# Altium project Enigma Rev A.PrjPCB (part 6 of 10)

## Sheet USB Hub.SchDoc: USB HUB
size Tabloid; ApprovedBy: NA; CompanyName: Cospan Design LLC; DrawnBy: Dave McCoy; Engineer: Dave McCoy; DocumentNumber: 9; Revision: A; SheetNumber: 9; SheetTotal: 20; Client: Public; Project: Enigma; ProjectPrettyName: Enigma
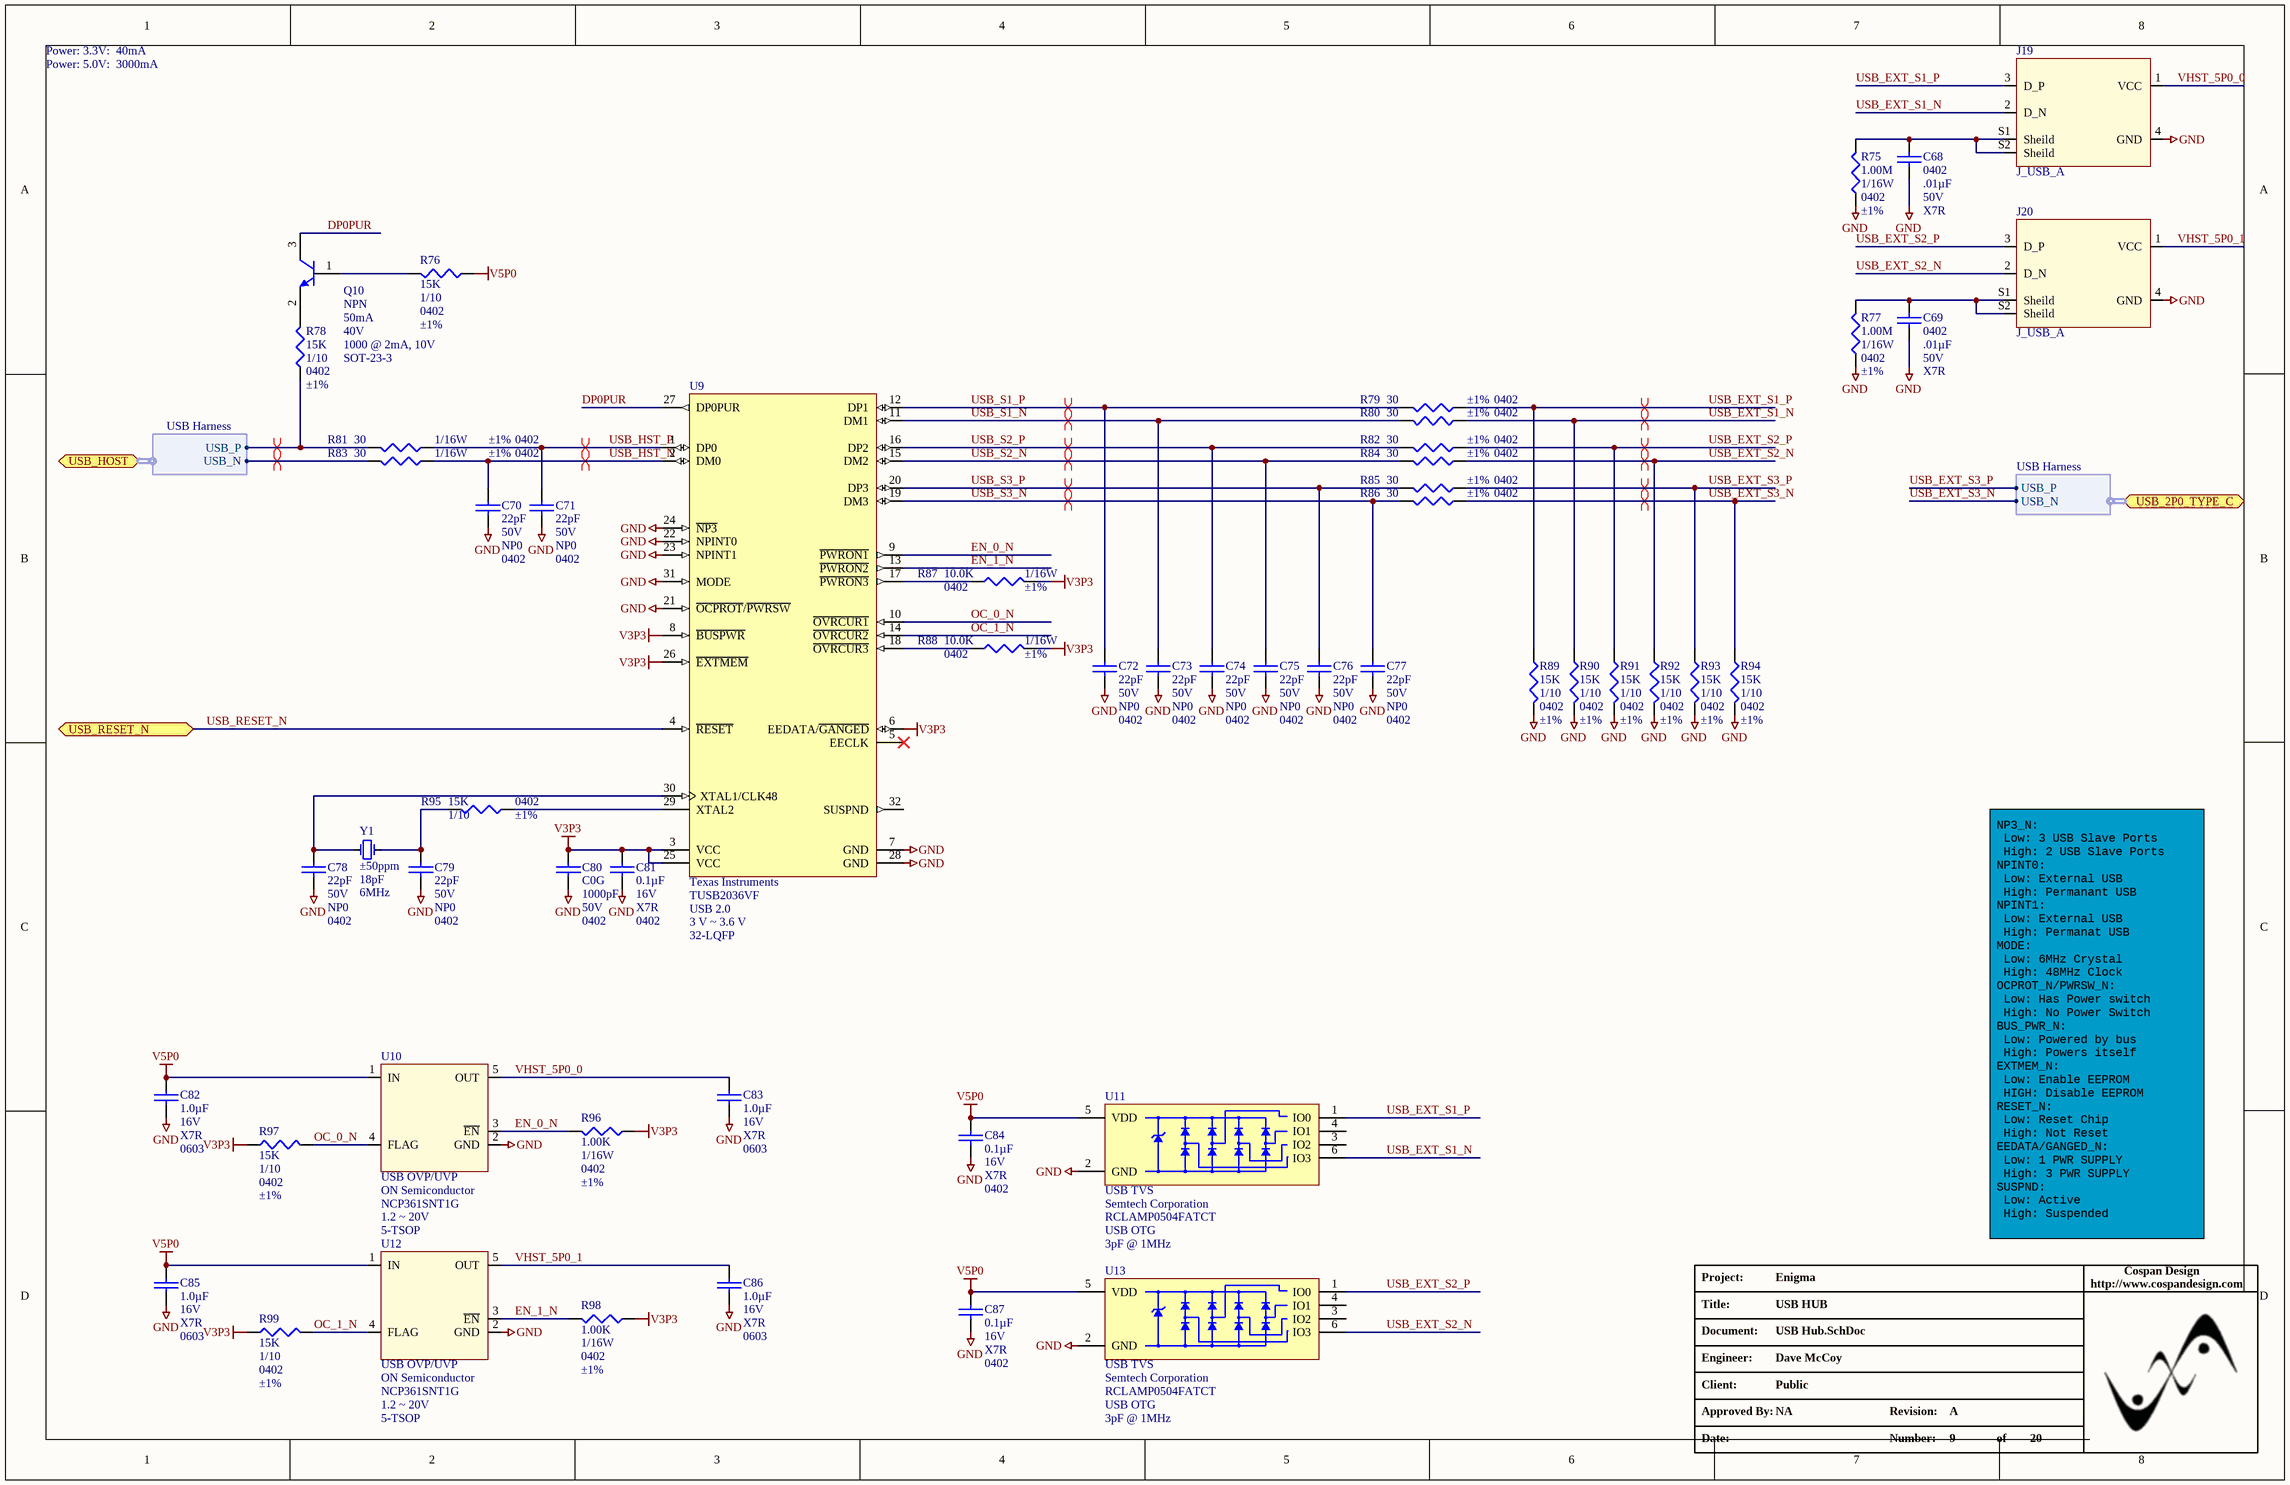
[diagram p11: USB Hub.SchDoc]

### Parts
C68  Package / Case: 0402  Capacitance: .01µF  Voltage - Rated: 50V  Temperature Coefficient: X7R  [C_0402]  (hidden comment: 10000pF)
C69  Package / Case: 0402  Capacitance: .01µF  Voltage - Rated: 50V  Temperature Coefficient: X7R  [C_0402]  (hidden comment: 10000pF)
C70  Voltage - Rated: 50V  Temperature Coefficient: NP0  Package / Case: 0402  [C_ERA-0402]  (hidden comment: 22pF)
C71  Voltage - Rated: 50V  Temperature Coefficient: NP0  Package / Case: 0402  [C_ERA-0402]  (hidden comment: 22pF)
C72  Voltage - Rated: 50V  Temperature Coefficient: NP0  Package / Case: 0402  [C_ERA-0402]  (hidden comment: 22pF)
C73  Voltage - Rated: 50V  Temperature Coefficient: NP0  Package / Case: 0402  [C_ERA-0402]  (hidden comment: 22pF)
C74  Voltage - Rated: 50V  Temperature Coefficient: NP0  Package / Case: 0402  [C_ERA-0402]  (hidden comment: 22pF)
C75  Voltage - Rated: 50V  Temperature Coefficient: NP0  Package / Case: 0402  [C_ERA-0402]  (hidden comment: 22pF)
C76  Voltage - Rated: 50V  Temperature Coefficient: NP0  Package / Case: 0402  [C_ERA-0402]  (hidden comment: 22pF)
C77  Voltage - Rated: 50V  Temperature Coefficient: NP0  Package / Case: 0402  [C_ERA-0402]  (hidden comment: 22pF)
C78  Voltage - Rated: 50V  Temperature Coefficient: NP0  Package / Case: 0402  [C_ERA-0402]  (hidden comment: 22pF)
C79  Voltage - Rated: 50V  Temperature Coefficient: NP0  Package / Case: 0402  [C_ERA-0402]  (hidden comment: 22pF)
C80  Temperature Coefficient: C0G  Voltage - Rated: 50V  Package / Case: 0402  [C_0402]  (hidden comment: 1000pF)
C81  Capacitance: 0.1µF  Voltage - Rated: 16V  Temperature Coefficient: X7R  Package / Case: 0402  [C_0402]  (hidden comment: 0.1uF)
C82  Capacitance: 1.0µF  Voltage - Rated: 16V  Temperature Coefficient: X7R  Package / Case: 0603  [C_ERA-0603]  (hidden comment: 1.0uF)
C83  Capacitance: 1.0µF  Voltage - Rated: 16V  Temperature Coefficient: X7R  Package / Case: 0603  [C_ERA-0603]  (hidden comment: 1.0uF)
C84  Capacitance: 0.1µF  Voltage - Rated: 16V  Temperature Coefficient: X7R  Package / Case: 0402  [C_0402]  (hidden comment: 0.1uF)
C85  Capacitance: 1.0µF  Voltage - Rated: 16V  Temperature Coefficient: X7R  Package / Case: 0603  [C_ERA-0603]  (hidden comment: 1.0uF)
C86  Capacitance: 1.0µF  Voltage - Rated: 16V  Temperature Coefficient: X7R  Package / Case: 0603  [C_ERA-0603]  (hidden comment: 1.0uF)
C87  Capacitance: 0.1µF  Voltage - Rated: 16V  Temperature Coefficient: X7R  Package / Case: 0402  [C_0402]  (hidden comment: 0.1uF)
J19  J_USB_A  [USB_A]
J20  J_USB_A  [USB_A]
Q10  Current - Collector (Ic) (Max): 50mA  Voltage - Collector Emitter Breakdown (Max): 40V  DC Current Gain (hFE) (Min) @ Ic, Vce: 1000 @ 2mA, 10V  Package / Case: SOT-23-3  [SOT-23A]  (hidden comment: NPN)
R75  Resistance In Ohms: 1.00M  Power (Watts): 1/16W  Case: 0402  Tolerance: ±1%  [R_0402]  (hidden comment: 1.0M Ohms)
R76  Resistance In Ohms: 15K  Power (Watts): 1/10  Case: 0402  Tolerance: ±1%  [R_0402]  (hidden comment: R_0402_15.0K)
R77  Resistance In Ohms: 1.00M  Power (Watts): 1/16W  Case: 0402  Tolerance: ±1%  [R_0402]  (hidden comment: 1.0M Ohms)
R78  Resistance In Ohms: 15K  Power (Watts): 1/10  Case: 0402  Tolerance: ±1%  [R_0402]  (hidden comment: R_0402_15.0K)
R79  Resistance In Ohms: 30  Case: 0402  Tolerance: ±1%  [R_0402]  (hidden comment: R_0402_30)
R80  Resistance In Ohms: 30  Case: 0402  Tolerance: ±1%  [R_0402]  (hidden comment: R_0402_30)
R81  Resistance In Ohms: 30  Power (Watts): 1/16W  Case: 0402  Tolerance: ±1%  [R_0402]  (hidden comment: R_0402_30)
R82  Resistance In Ohms: 30  Case: 0402  Tolerance: ±1%  [R_0402]  (hidden comment: R_0402_30)
R83  Resistance In Ohms: 30  Power (Watts): 1/16W  Case: 0402  Tolerance: ±1%  [R_0402]  (hidden comment: R_0402_30)
R84  Resistance In Ohms: 30  Case: 0402  Tolerance: ±1%  [R_0402]  (hidden comment: R_0402_30)
R85  Resistance In Ohms: 30  Case: 0402  Tolerance: ±1%  [R_0402]  (hidden comment: R_0402_30)
R86  Resistance In Ohms: 30  Case: 0402  Tolerance: ±1%  [R_0402]  (hidden comment: R_0402_30)
R87  Resistance In Ohms: 10.0K  Power (Watts): 1/16W  Case: 0402  Tolerance: ±1%  [R_0402]  (hidden comment: R_0402_10.0K)
R88  Resistance In Ohms: 10.0K  Power (Watts): 1/16W  Case: 0402  Tolerance: ±1%  [R_0402]  (hidden comment: R_0402_10.0K)
R89  Resistance In Ohms: 15K  Power (Watts): 1/10  Case: 0402  Tolerance: ±1%  [R_0402]  (hidden comment: R_0402_15.0K)
R90  Resistance In Ohms: 15K  Power (Watts): 1/10  Case: 0402  Tolerance: ±1%  [R_0402]  (hidden comment: R_0402_15.0K)
R91  Resistance In Ohms: 15K  Power (Watts): 1/10  Case: 0402  Tolerance: ±1%  [R_0402]  (hidden comment: R_0402_15.0K)
R92  Resistance In Ohms: 15K  Power (Watts): 1/10  Case: 0402  Tolerance: ±1%  [R_0402]  (hidden comment: R_0402_15.0K)
R93  Resistance In Ohms: 15K  Power (Watts): 1/10  Case: 0402  Tolerance: ±1%  [R_0402]  (hidden comment: R_0402_15.0K)
R94  Resistance In Ohms: 15K  Power (Watts): 1/10  Case: 0402  Tolerance: ±1%  [R_0402]  (hidden comment: R_0402_15.0K)
R95  Resistance In Ohms: 15K  Power (Watts): 1/10  Case: 0402  Tolerance: ±1%  [R_0402]  (hidden comment: R_0402_15.0K)
R96  Resistance In Ohms: 1.00K  Power (Watts): 1/16W  Case: 0402  Tolerance: ±1%  [R_0402]  (hidden comment: 1.0k Ohms)
R97  Resistance In Ohms: 15K  Power (Watts): 1/10  Case: 0402  Tolerance: ±1%  [R_0402]  (hidden comment: R_0402_15.0K)
R98  Resistance In Ohms: 1.00K  Power (Watts): 1/16W  Case: 0402  Tolerance: ±1%  [R_0402]  (hidden comment: 1.0k Ohms)
R99  Resistance In Ohms: 15K  Power (Watts): 1/10  Case: 0402  Tolerance: ±1%  [R_0402]  (hidden comment: R_0402_15.0K)
U9  Manufacturer: Texas Instruments  Manufacturer Part Number: TUSB2036VF  Standards: USB 2.0  Voltage - Supply: 3 V ~ 3.6 V  Package / Case: 32-LQFP  [VF32_L]  (hidden comment: U_TI-TUSB2036-LQFP_VF-32)
U10  USB OVP/UVP  Manufacturer: ON Semiconductor  Manufacturer Part Number: NCP361SNT1G  Voltage - Working: 1.2 ~ 20V  Supplier Device Package: 5-TSOP  [SOT95P280X90-5N]
U11  USB TVS  Manufacturer: Semtech Corporation  Manufacturer Part Number: RCLAMP0504FATCT  Applications: USB OTG  Capacitance @ Frequency: 3pF @ 1MHz  [SC70-LT6_N]
U12  USB OVP/UVP  Manufacturer: ON Semiconductor  Manufacturer Part Number: NCP361SNT1G  Voltage - Working: 1.2 ~ 20V  Supplier Device Package: 5-TSOP  [SOT95P280X90-5N]
U13  USB TVS  Manufacturer: Semtech Corporation  Manufacturer Part Number: RCLAMP0504FATCT  Applications: USB OTG  Capacitance @ Frequency: 3pF @ 1MHz  [SC70-LT6_N]
Y1  Frequency Stability: ±50ppm  Load Capacitance: 18pF  Frequency: 6MHz  [HC49]  (hidden comment: 6.00MHz Crystal)

### Ports
USB_2P0_TYPE_C (harness USB Harness), USB_HOST (harness USB Harness), USB_RESET_N

### Harnesses
USB Harness: USB_P, USB_N

### Nets
GND: C68.1 C69.1 C70.1 C71.1 C72.1 C73.1 C74.1 C75.1 C76.1 C77.1 C78.1 C79.1 C80.1 C81.1 C82.1 C83.1 C84.1 C85.1 C86.1 C87.1 J19.4(GND) J20.4(GND) R75.2 R77.2 R89.1 R90.1 R91.1 R92.1 R93.1 R94.1 U9.7(GND) U9.21(~{OCPROT}/~{PWRSW}) U9.22(NPINT0) U9.23(NPINT1) U9.24(~{NP3}) U9.28(GND) U9.31(MODE) U10.2(GND) U11.2(GND) U12.2(GND) U13.2(GND)
V3P3: C80.2 C81.2 R87.1 R88.1 R96.2 R97.2 R98.2 R99.2 U9.3(VCC) U9.6(EEDATA/~{GANGED}) U9.8(~{BUSPWR}) U9.25(VCC) U9.26(~{EXTMEM})
V5P0: C82.2 C84.2 C85.2 C87.2 R76.2 U10.1(IN) U11.5(VDD) U12.1(IN) U13.5(VDD)
DP0PUR: Q10.3(C) U9.27(DP0PUR)
EN_0_N: R96.1 U9.9(~{PWRON1}) U10.3(~{EN})
EN_1_N: R98.1 U9.13(~{PWRON2}) U12.3(~{EN})
OC_0_N: R97.1 U9.10(~{OVRCUR1}) U10.4(FLAG)
OC_1_N: R99.1 U9.14(~{OVRCUR2}) U12.4(FLAG)
USB_EXT_S1_N: J19.2(D_N) R80.2 R90.2 U11.6(IO3)
USB_EXT_S1_P: J19.3(D_P) R79.2 R89.2 U11.1(IO0)
USB_EXT_S2_N: J20.2(D_N) R84.2 R92.2 U13.6(IO3)
USB_EXT_S2_P: J20.3(D_P) R82.2 R91.2 U13.1(IO0)
USB_EXT_S3_N: R86.2 R94.2 ; port USB_2P0_TYPE_C.USB_N  [project net USB_2P0_N]
USB_EXT_S3_P: R85.2 R93.2 ; port USB_2P0_TYPE_C.USB_P  [project net USB_2P0_P]
USB_HOST_N: R83.1 ; port USB_HOST.USB_N
USB_HOST_P: R78.2 R81.1 ; port USB_HOST.USB_P
USB_HST_N: C70.2 R83.2 U9.2(DM0)
USB_HST_P: C71.2 R81.2 U9.1(DP0)
USB_RESET_N: U9.4(~{RESET}) ; port USB_RESET_N  [project net ULPI_RST_N]
USB_S1_N: C73.2 R80.1 U9.11(DM1)
USB_S1_P: C72.2 R79.1 U9.12(DP1)
USB_S2_N: C75.2 R84.1 U9.15(DM2)
USB_S2_P: C74.2 R82.1 U9.16(DP2)
USB_S3_N: C77.2 R86.1 U9.19(DM3)
USB_S3_P: C76.2 R85.1 U9.20(DP3)
VHST_5P0_0: C83.2 J19.1(VCC) U10.5(OUT)
VHST_5P0_1: C86.2 J20.1(VCC) U12.5(OUT)
NetC68_2: C68.2 J19.S1(Sheild) J19.S2(Sheild) R75.1
NetC69_2: C69.2 J20.S1(Sheild) J20.S2(Sheild) R77.1
NetC78_2: C78.2 U9.30(XTAL1/CLK48) Y1.2
NetC79_2: C79.2 R95.1 Y1.1
NetQ10_1: Q10.1(B) R76.1
NetQ10_2: Q10.2(E) R78.1
NetR87_2: R87.2 U9.17(~{PWRON3})
NetR88_2: R88.2 U9.18(~{OVRCUR3})
NetR95_2: R95.2 U9.29(XTAL2)

Not connected (* = marked no-connect by the designer): U9 5(EECLK)* 32(SUSPND); U11 3(IO2) 4(IO1); U13 3(IO2) 4(IO1)

### Layout directives
differential pair: USB_2P0_N, USB_2P0_P, USB_EXT_S1_N, USB_EXT_S1_P, USB_EXT_S2_N, USB_EXT_S2_P, USB_HOST_N, USB_HOST_P, USB_HST_N, USB_HST_P, USB_S1_N, USB_S1_P, USB_S2_N, USB_S2_P, USB_S3_N, USB_S3_P

### Notes on the sheet
- Power: 3.3V:  40mA
- Power: 5.0V:  3000mA
- NP3_N:
  Low: 3 USB Slave Ports
  High: 2 USB Slave Ports
  NPINT0:
  Low: External USB
  High: Permanant USB
  NPINT1:
  Low: External USB
  High: Permanat USB
  MODE:
  Low: 6MHz Crystal
  High: 48MHz Clock
  OCPROT_N/PWRSW_N:
  Low: Has Power switch
  High: No Power Switch
  BUS_PWR_N:
  Low: Powered by bus
  High: Powers itself
  EXTMEM_N:
  Low: Enable EEPROM
  HIGH: Disable EEPROM
  RESET_N:
  Low: Reset Chip
  High: Not Reset
  EEDATA/GANGED_N:
  Low: 1 PWR SUPPLY
  High: 3 PWR SUPPLY
  SUSPND:
  Low: Active
  High: Suspended
- Project:
- http://www.cospandesign.com
- Cospan Design
- Document:
- Engineer:
- Title:
- Client:
- Approved By:
- Revision:
- Date:
- Number:
- of

### Library data of the parts
C68 C69 = C_0402_10000PF_50V: CAP CERAMIC .01UF 50V X7R 0402; Manufacturer: Murata Electronics North America; Manufacturer Part Number: GRM155R71H103KA88D; Tolerance: ±10%; Supplier 1: Digi-Key; RoHS: RoHS Compliant; Category: Capacitors; Stock 1: 7255009; Pricing 1: 1=0.1, 50=0.0052, 100=0.0044, 250=0.00364, 500=0.00312, 1000=0.00242, 5000=0.00202 (USD); Packaging: Cut Tape (CT); Part Status: Active; Operating Temperature: -55°C ~ 125°C; Features: -; Ratings: -; Applications: General Purpose; Mounting Type: Surface Mount, MLCC; Size / Dimension: 0.039" L x 0.020" W (1.00mm x 0.50mm); Height - Seated (Max): -; Thickness (Max): 0.022" (0.55mm); Lead Spacing: -; Lead Style: -; ComponentLink1URL: http://www.murata.com/~/media/webrenewal/support/library/catalog/products/capacitor/mlcc/c02e.ashx; ComponentLink1Description: http://www.murata.com/~/media/webrenewal/support/library/catalog/products/capacitor/mlcc/c02e.ashx; Supplier Part Number 1: 490-4516-1-ND
C70-C79 = C_0402_22PF_50V: CAP CER 22PF 50V NP0 0402; Manufacturer: Murata Electronics North America; Manufacturer Part Number: GRM1555C1H220FA01D; Tolerance: ±1%; Description: CAP CER 22PF 50V C0G/NP0 0402; Supplier 1: Digi-Key; RoHS: RoHS Compliant; Category: Capacitors; Stock 1: 606100; Pricing 1: 1=0.1, 10=0.05, 100=0.0223, 500=0.01594, 1000=0.01252, 2500=0.01138, 5000=0.01047 (USD); Packaging: Cut Tape (CT); Part Status: Active; Operating Temperature: -55°C ~ 125°C; Features: -; Ratings: -; Applications: General Purpose; Mounting Type: Surface Mount, MLCC; Size / Dimension: 0.039" L x 0.020" W (1.00mm x 0.50mm); Height - Seated (Max): -; Thickness (Max): 0.022" (0.55mm); Lead Spacing: -; Lead Style: -; ComponentLink1URL: http://search.murata.co.jp/Ceramy/image/img/A01X/G101/ENG/GRM1555C1H220FA01-01.pdf; ComponentLink1Description: http://search.murata.co.jp/Ceramy/image/img/A01X/G101/ENG/GRM1555C1H220FA01-01.pdf; Supplier Part Number 1: 490-8589-1-ND; Capacitance: 22pF
C80 = C_0402_1000PF_50V: CAP CER 1000PF 50V C0G 0402; Manufacturer: Murata Electronics North America; Manufacturer Part Number: GRM1555C1H102JA01D; Tolerance: ±5%; Supplier 1: Digi-Key; RoHS: RoHS Compliant; Category: Capacitors; Stock 1: 1327660; Pricing 1: 10=0.073, 100=0.0429, 500=0.02476, 1000=0.01716 (USD); Mounting Type: Surface Mount, MLCC; Operating Temperature: -55°C ~ 125°C; Features: -; Applications: General Purpose; Ratings: -; Size / Dimension: 0.040" L x 0.020" W (1.00mm x 0.50mm); Lead Spacing: -; Thickness: 0.50mm; Packaging: Cut Tape (CT); Lead Style: -; ComponentLink1URL: http://search.murata.co.jp/Ceramy/image/img/PDF/ENG/GRM1555C1H102JA01.pdf; ComponentLink1Description: http://search.murata.co.jp/Ceramy/image/img/PDF/ENG/GRM1555C1H102JA01.pdf; Supplier Part Number 1: 490-3244-1-ND; Capacitance: 1000pF
C81 C84 C87 = C_0402_0.1UF_16V: CAP CER .10UF 16V X7R 0402; Manufacturer: Murata Electronics North America; Manufacturer Part Number: GRM155R71C104KA88J; Tolerance: ±10%; Description: CAP CER 0.1UF 16V X7R 0402; Supplier 1: Digi-Key; RoHS: RoHS Compliant; Category: Capacitors; Stock 1: 18103134; Pricing 1: 1=0.1, 10=0.014, 100=0.0062, 500=0.00442, 1000=0.00348, 2500=0.00316, 5000=0.00291 (USD); Packaging: Cut Tape (CT); Part Status: Active; Operating Temperature: -55°C ~ 125°C; Features: -; Ratings: -; Applications: General Purpose; Mounting Type: Surface Mount, MLCC; Size / Dimension: 0.039" L x 0.020" W (1.00mm x 0.50mm); Height - Seated (Max): -; Thickness (Max): 0.022" (0.55mm); Lead Spacing: -; ComponentLink1URL: http://www.murata.com/~/media/webrenewal/support/library/catalog/products/capacitor/mlcc/c02e.ashx?la=en-us; ComponentLink1Description: http://www.murata.com/~/media/webrenewal/support/library/catalog/products/capacitor/mlcc/c02e.ashx?la=en-us; Supplier Part Number 1: 490-6328-1-ND
C82 C83 C85 C86 = C_0603_1.0uF_16V: CAP CER 1UF 16V 10% X7R 0603; Manufacturer: Yageo; Manufacturer Part Number: CC0603KRX7R7BB105; Description: CAP CER 1UF 16V X7R 0603; Supplier 1: Digi-Key; Supplier Part Number 1: 311-1446-1-ND; RoHS: RoHS Compliant; Category: Capacitors; Stock 1: 221087; Tolerance: ±10%; Mounting Type: Surface Mount, MLCC; Operating Temperature: -55°C ~ 125°C; Applications: General Purpose; Ratings: -; Size / Dimension: 0.063" L x 0.032" W (1.60mm x 0.80mm); Height - Seated (Max): -; Thickness (Max): 0.035" (0.90mm); Lead Spacing: -; Features: -; Packaging: Cut Tape (CT); Lead Style: -; ComponentLink1URL: http://www.yageo.com/documents/recent/UPY-GPHC_X7R_6.3V-to-50V_18.pdf; ComponentLink1Description: http://www.yageo.com/documents/recent/UPY-GPHC_X7R_6.3V-to-50V_18.pdf; Pricing 1: 1=0.1, 10=0.053, 100=0.0237, 500=0.01694, 1000=0.01331 (USD); Part Status: Active; Failure Rate: -
J19 J20 = J_USB_A: CONN PLUG USB A 4POS SMD R/A; Manufacturer: Molex Inc; Manufacturer Part Number: 0480372200; Connector Type: USB - A; Number of Contacts: 4; Specifications: USB 2.0; Supplier 1: Digi-Key; Supplier Part Number 1: WM3983CT-ND; RoHS: RoHS Compliant; Category: Connectors, Interconnects; Stock 1: 3244; Pricing: 1=1.24, 10=1.026, 25=0.9636, 50=0.8548, 100=0.7692 (USD); Gender: Plug; Mounting Type: Surface Mount, Right Angle, Horizontal; Features: Shielded; Packaging: Cut Tape (CT); Ingress Protection: -; ComponentLink1URL: http://www.molex.com/elqNow/elqRedir.htm?ref=http://www.molex.com/pdm_docs/sd/480372200_sd.pdf; ComponentLink1Description: http://www.molex.com/elqNow/elqRedir.htm?ref=http://www.molex.com/pdm_docs/sd/480372200_sd.pdf
Q10 = Q_NPN_40MA_HFE_1000: TRANS NPN 40V 50MA MINI3; Manufacturer: Panasonic Electronic Components - Semiconductor Products; Manufacturer Part Number: DSC2A01T0L; Vce Saturation (Max) @ Ib, Ic: 200mV @ 1mA, 10mA; Current - Collector Cutoff (Max): 1µA; Power - Max: 200mW; Frequency - Transition: 150MHz; Supplier 1: Digi-Key; Supplier Part Number 1: DSC2A01T0LCT-ND; RoHS: RoHS Compliant; Category: Discrete Semiconductor Products; Stock 1: 2697; Pricing: 1=0.4, 25=0.2248, 100=0.1701, 250=0.12036, 500=0.0963, 1000=0.07383 (USD); Mounting Type: Surface Mount; Supplier Device Package: Mini3-G3-B; Packaging: Cut Tape (CT); ComponentLink1URL: http://industrial.panasonic.com/www-cgi/jvcr13pz.cgi?E+SC+4+AJA7004+DSC2A01+8+WW; ComponentLink1Description: http://industrial.panasonic.com/www-cgi/jvcr13pz.cgi?E+SC+4+AJA7004+DSC2A01+8+WW; Transistor Type: NPN
R75 R77 = R_0402_1.0M: RES 1.00M OHM 1/16W 1% 0402 SMD; Manufacturer: Yageo; Manufacturer Part Number: RC0402FR-071ML; Temperature Coefficient: ±100ppm/°C; Description: RES SMD 1M OHM 1% 1/16W 0402; Supplier 1: Digi-Key; RoHS: RoHS Compliant; Category: Resistors; Stock 1: 5123255; Composition: Thick Film; Features: Moisture Resistant; Packaging: Cut Tape (CT); ComponentLink1URL: http://www.yageo.com/documents/recent/PYu-RC_Group_51_RoHS_L_7.pdf; ComponentLink1Description: http://www.yageo.com/documents/recent/PYu-RC_Group_51_RoHS_L_7.pdf; Supplier Part Number 1: 311-1.00MLRCT-ND; Pricing 1: 1=0.1, 10=0.014, 100=0.0056, 1000=0.00253, 2500=0.0022, 5000=0.00181 (USD); Part Status: Active; Operating Temperature: -55°C ~ 155°C; Package / Case: 0402 (1005 Metric); Supplier Device Package: 0402; Size / Dimension: 0.039" L x 0.020" W (1.00mm x 0.50mm); Height - Seated (Max): 0.016" (0.40mm); Failure Rate: -
R76 R78 R89-R95 R97 R99 = R_0402_15.0K: RES 15.0K OHM 1/10W 1% 0402 SMD; Manufacturer: Panasonic - ECG; Manufacturer Part Number: ERJ-2RKF1502X; Temperature Coefficient: ±100ppm/°C; Supplier 1: Digi-Key; Supplier Part Number 1: P15.0KLCT-ND; RoHS: RoHS Compliant; Category: Resistors; Stock 1: 695227; Pricing: 1=0.06, 50=0.0242, 100=0.0184, 250=0.01364, 500=0.01008, 1000=0.00672, 5000=0.00473 (USD); Resistance (Ohms): 15K; Composition: Thick Film; Features: -; Size / Dimension: 0.039" L x 0.020" W (1.00mm x 0.50mm); Height: 0.016" (0.40mm); Number of Terminations: 2; Packaging: Cut Tape (CT); Package / Case: 0402 (1005 Metric); ComponentLink1URL: http://industrial.panasonic.com/www-cgi/jvcr13pz.cgi?E+PZ+3+AOA0002+ERJ2RKF1502X+7+WW; ComponentLink1Description: http://industrial.panasonic.com/www-cgi/jvcr13pz.cgi?E+PZ+3+AOA0002+ERJ2RKF1502X+7+WW
R79 R80 R82 R84-R86 = R_0402_30: RES SMD 30 OHM 1% 1/10W 0402; Manufacturer: Panasonic Electronic Components; Manufacturer Part Number: ERJ-2RKF30R0X; Temperature Coefficient: ±100ppm/°C; Power (Watts): 1/16W; Supplier 1: Digi-Key; RoHS: RoHS Compliant; Category: Resistors; Stock 1: 102312; Pricing 1: 1=0.1, 10=0.028, 100=0.0113, 1000=0.00509, 2500=0.00442, 5000=0.00365 (USD); Packaging: Cut Tape (CT); Part Status: Active; Resistance (Ohms): 30; Composition: Thick Film; Features: Automotive AEC-Q200; Operating Temperature: -55°C ~ 155°C; Package / Case: 0402 (1005 Metric); Supplier Device Package: 0402; Size / Dimension: 0.039" L x 0.020" W (1.00mm x 0.50mm); Height - Seated (Max): 0.016" (0.40mm); Failure Rate: -; ComponentLink1URL: http://media.digikey.com/pdf/Data%20Sheets/Panasonic%20Electronic%20Components/ERJ%20Series_Precision.pdf; ComponentLink1Description: http://media.digikey.com/pdf/Data%20Sheets/Panasonic%20Electronic%20Components/ERJ%20Series_Precision.pdf; Supplier Part Number 1: P30.0LCT-ND
R81 R83 = R_0402_30: RES SMD 30 OHM 1% 1/10W 0402; Manufacturer: Panasonic Electronic Components; Manufacturer Part Number: ERJ-2RKF30R0X; Temperature Coefficient: ±100ppm/°C; Supplier 1: Digi-Key; RoHS: RoHS Compliant; Category: Resistors; Stock 1: 102312; Pricing 1: 1=0.1, 10=0.028, 100=0.0113, 1000=0.00509, 2500=0.00442, 5000=0.00365 (USD); Packaging: Cut Tape (CT); Part Status: Active; Resistance (Ohms): 30; Composition: Thick Film; Features: Automotive AEC-Q200; Operating Temperature: -55°C ~ 155°C; Package / Case: 0402 (1005 Metric); Supplier Device Package: 0402; Size / Dimension: 0.039" L x 0.020" W (1.00mm x 0.50mm); Height - Seated (Max): 0.016" (0.40mm); Failure Rate: -; ComponentLink1URL: http://media.digikey.com/pdf/Data%20Sheets/Panasonic%20Electronic%20Components/ERJ%20Series_Precision.pdf; ComponentLink1Description: http://media.digikey.com/pdf/Data%20Sheets/Panasonic%20Electronic%20Components/ERJ%20Series_Precision.pdf; Supplier Part Number 1: P30.0LCT-ND
R87 R88 = R_0402_10.0K: RES 10.0K OHM 1/16W 1% 0402 SMD; Manufacturer: Stackpole Electronics Inc; Manufacturer Part Number: RMCF0402FT10K0; Resistance (Ohms): 10k; Temperature Coefficient: ±100ppm/°C; Supplier 1: Digi-Key; Supplier Part Number 1: RMCF0402FT10K0CT-ND; RoHS: RoHS Compliant; Category: Resistors; Stock 1: 234525; Pricing: 1=0.04, 10=0.025, 50=0.0138, 100=0.0105, 250=0.0078, 500=0.00576, 1000=0.00384, 2500=0.00324, 5000=0.0027 (USD); Composition: Thick Film; Features: -; Package / Case: 0402 (1005 Metric); Size / Dimension: 0.039" L x 0.020" W (1.00mm x 0.50mm); Height: 0.016" (0.40mm); Number of Terminations: 2; Packaging: Cut Tape (CT); ComponentLink1URL: http://www.seielect.com/Catalog/SEI-RMCF_RMCP.pdf; ComponentLink1Description: http://www.seielect.com/Catalog/SEI-RMCF_RMCP.pdf
R96 R98 = R_0402_1.0K: RES 1.00K OHM 1/16W 1% 0402 SMD; Manufacturer: Yageo; Manufacturer Part Number: RC0402FR-071KL; Resistance (Ohms): 1K; Temperature Coefficient: ±100ppm/°C; Supplier 1: Digi-Key; Supplier Part Number 1: 311-1.00KLRCT-ND; RoHS: RoHS Compliant; Category: Resistors; Stock 1: 2103351; Pricing: 10=0.014, 100=0.0063, 500=0.00382, 1000=0.0027, 5000=0.00203 (USD); Composition: Thick Film; Features: -; Package / Case: 0402 (1005 Metric); Size / Dimension: 0.039" L x 0.020" W (1.00mm x 0.50mm); Height: 0.016" (0.40mm); Number of Terminations: 2; Packaging: Cut Tape (CT); ComponentLink1URL: http://www.yageo.com/documents/recent/PYu-RC0402_51_RoHS_L_6.pdf; ComponentLink1Description: http://www.yageo.com/documents/recent/PYu-RC0402_51_RoHS_L_6.pdf
U9 = U_TI-TUSB2036-LQFP_VF-32: IC 2/3-PORT USB HUB 32-LQFP; Function: Hub Controller; Current - Supply: 40mA; Description: IC HUB CONTROLLER USB 2.0 32LQFP; Supplier 1: Digi-Key; RoHS: RoHS Compliant; Category: Integrated Circuits (ICs); Stock 1: 822; Pricing 1: 1=3.22, 10=2.889, 100=2.3673, 500=2.01524, 1000=1.6996 (USD); Packaging: Tray; Part Status: Active; Protocol: USB; Interface: USB; Operating Temperature: 0°C ~ 70°C; Supplier Device Package: 32-LQFP (7x7); ComponentLink1URL: http://www.ti.com/lit/ds/symlink/tusb2036.pdf; ComponentLink1Description: http://www.ti.com/lit/ds/symlink/tusb2036.pdf; Supplier Part Number 1: 296-11086-ND
U10 U12 = U_NCP361SNT1G: IC USB POS OVP/OCP 5TSOP; Number of Circuits: 1; Supplier 1: Digi-Key; RoHS: RoHS Compliant; Category: Circuit Protection; Stock 1: 3029; Pricing 1: 1=0.74, 10=0.65, 25=0.5744, 100=0.5004, 250=0.4356, 500=0.3708, 1000=0.297 (USD); Packaging: Cut Tape (CT); Voltage - Clamping: -; Technology: Mixed Technology; Power (Watts): -; Applications: General Purpose; Package / Case: 6-TSOP (0.059", 1.50mm Width) 5 leads; ComponentLink1URL: http://www.onsemi.com/pub_link/Collateral/NCP361-D.PDF; ComponentLink1Description: http://www.onsemi.com/pub_link/Collateral/NCP361-D.PDF; Supplier Part Number 1: NCP361SNT1GOSCT-ND
U11 U13 = U_USB_TVS_SCV70: TVS DIODE 5VWM 25VC SC70-6; Unidirectional Channels: 4; Voltage - Reverse Standoff (Typ): 5V (Max); Voltage - Breakdown (Min): 6V; Voltage - Clamping (Max) @ Ipp: 25V; Current - Peak Pulse (10/1000µs): 6A (8/20µs); Power - Peak Pulse: 150W; Power Line Protection: Yes; Supplier 1: Digi-Key; RoHS: RoHS Compliant; Category: Circuit Protection; Stock 1: 13620; Pricing 1: 1=1.25, 10=1.107, 25=0.9996, 100=0.8747, 250=0.76756, 500=0.6783, 1000=0.5355 (USD); Packaging: Cut Tape (CT); Part Status: Active; Type: Steering (Rail to Rail); Bidirectional Channels: -; Operating Temperature: -55°C ~ 125°C (TJ); Mounting Type: Surface Mount; Package / Case: 6-TSSOP, SC-88, SOT-363; Supplier Device Package: SC-70-6; ComponentLink1URL: http://www.semtech.com/images/datasheet/rclamp0504fa.pdf; ComponentLink1Description: http://www.semtech.com/images/datasheet/rclamp0504fa.pdf; Supplier Part Number 1: RCLAMP0504FATCTCT-ND
Y1 = Y_SMD_6.00MHZ_18PF: CRYSTAL 6.0000MHZ 18PF SMD; Manufacturer: Abracon LLC; Manufacturer Part Number: ABLS-6.000MHZ-D-T; ESR (Equivalent Series Resistance): 100 Ohm; Operating Mode: Fundamental; Supplier 1: Digi-Key; RoHS: RoHS Compliant; Category: Crystals, Oscillators, Resonators; Stock 1: 186; Pricing 1: 1=0.28, 10=0.231, 50=0.208, 100=0.1848, 500=0.17556 (USD); Packaging: Cut Tape (CT); Part Status: Active; Type: MHz Crystal; Frequency Tolerance: ±50ppm; Operating Temperature: -40°C ~ 85°C; Ratings: -; Mounting Type: Surface Mount; Package / Case: HC49/US; Size / Dimension: 0.449" L x 0.185" W (11.40mm x 4.70mm); Height - Seated (Max): 0.165" (4.20mm); ComponentLink1URL: http://www.abracon.com/Resonators/abls.pdf; ComponentLink1Description: http://www.abracon.com/Resonators/abls.pdf; Supplier Part Number 1: 535-13443-1-ND

## Sheet I2S Audio.SchDoc: I2S Codec/Amplifier
size Tabloid; ApprovedBy: NA; CompanyName: Cospan Design LLC; DrawnBy: Dave McCoy; Engineer: Dave McCoy; DocumentNumber: 13; Revision: A; SheetNumber: 13; SheetTotal: 20; Client: Public; Project: Enigma; ProjectPrettyName: Enigma
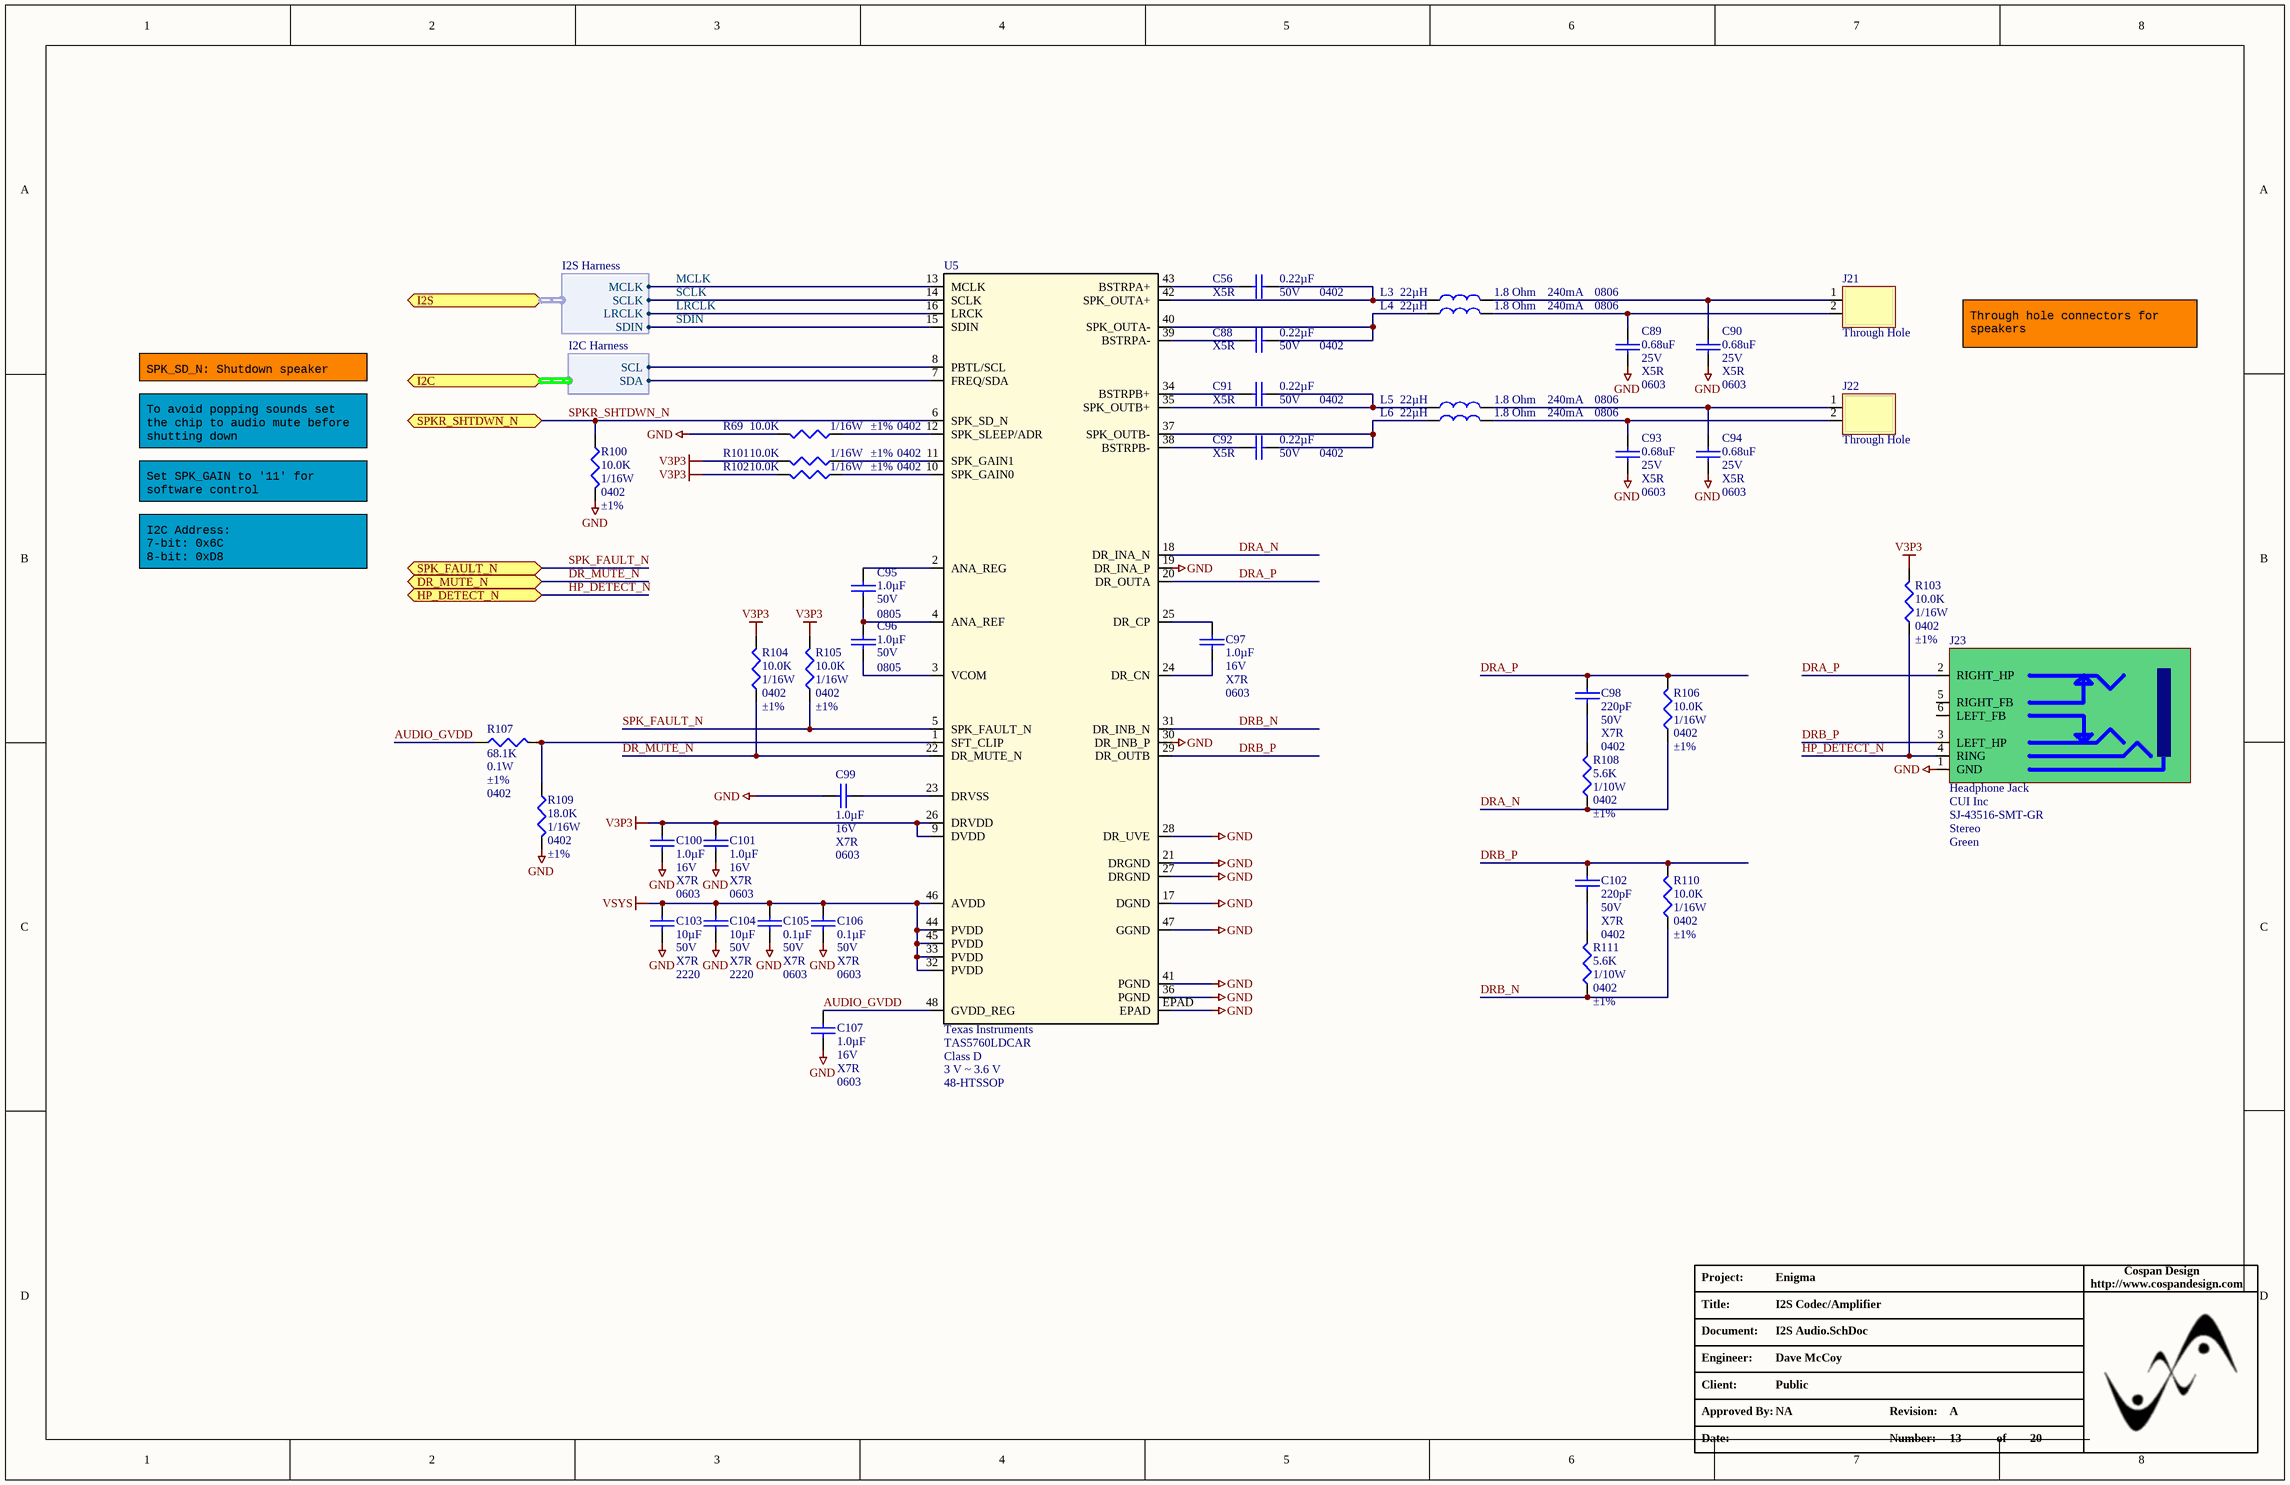
[diagram p12: I2S Audio.SchDoc]

### Parts
C56  Capacitance: 0.22µF  Voltage - Rated: 50V  Temperature Coefficient: X5R  Package / Case: 0402  [C_0402]  (hidden comment: C_0402_0.22UF_50V)
C88  Capacitance: 0.22µF  Voltage - Rated: 50V  Temperature Coefficient: X5R  Package / Case: 0402  [C_0402]  (hidden comment: C_0402_0.22UF_50V)
C89  Capacitance: 0.68uF  Voltage - Rated: 25V  Temperature Coefficient: X5R  Package / Case: 0603  [C_ERA-0603]  (hidden comment: C_0603_0.68uF_25V)
C90  Capacitance: 0.68uF  Voltage - Rated: 25V  Temperature Coefficient: X5R  Package / Case: 0603  [C_ERA-0603]  (hidden comment: C_0603_0.68uF_25V)
C91  Capacitance: 0.22µF  Voltage - Rated: 50V  Temperature Coefficient: X5R  Package / Case: 0402  [C_0402]  (hidden comment: C_0402_0.22UF_50V)
C92  Capacitance: 0.22µF  Voltage - Rated: 50V  Temperature Coefficient: X5R  Package / Case: 0402  [C_0402]  (hidden comment: C_0402_0.22UF_50V)
C93  Capacitance: 0.68uF  Voltage - Rated: 25V  Temperature Coefficient: X5R  Package / Case: 0603  [C_ERA-0603]  (hidden comment: C_0603_0.68uF_25V)
C94  Capacitance: 0.68uF  Voltage - Rated: 25V  Temperature Coefficient: X5R  Package / Case: 0603  [C_ERA-0603]  (hidden comment: C_0603_0.68uF_25V)
C95  Capacitance: 1.0µF  Voltage - Rated: 50V  Package / Case: 0805  [C_ERA-0805]  (hidden comment: 1.0uF)
C96  Capacitance: 1.0µF  Voltage - Rated: 50V  Package / Case: 0805  [C_ERA-0805]  (hidden comment: 1.0uF)
C97  Capacitance: 1.0µF  Voltage - Rated: 16V  Temperature Coefficient: X7R  Package / Case: 0603  [C_ERA-0603]  (hidden comment: 1.0uF)
C98  Voltage - Rated: 50V  Temperature Coefficient: X7R  Package / Case: 0402  [C_0402]  (hidden comment: 220pF)
C99  Capacitance: 1.0µF  Voltage - Rated: 16V  Temperature Coefficient: X7R  Package / Case: 0603  [C_ERA-0603]  (hidden comment: 1.0uF)
C100  Capacitance: 1.0µF  Voltage - Rated: 16V  Temperature Coefficient: X7R  Package / Case: 0603  [C_ERA-0603]  (hidden comment: 1.0uF)
C101  Capacitance: 1.0µF  Voltage - Rated: 16V  Temperature Coefficient: X7R  Package / Case: 0603  [C_ERA-0603]  (hidden comment: 1.0uF)
C102  Voltage - Rated: 50V  Temperature Coefficient: X7R  Package / Case: 0402  [C_0402]  (hidden comment: 220pF)
C103  Voltage - Rated: 50V  Temperature Coefficient: X7R  Package / Case: 2220  [C_ERA-2220]  (hidden comment: 10µF)
C104  Voltage - Rated: 50V  Temperature Coefficient: X7R  Package / Case: 2220  [C_ERA-2220]  (hidden comment: 10µF)
C105  Capacitance: 0.1µF  Voltage - Rated: 50V  Temperature Coefficient: X7R  Package / Case: 0603  [C_ERA-0603]  (hidden comment: C_0603_0.1µF)
C106  Capacitance: 0.1µF  Voltage - Rated: 50V  Temperature Coefficient: X7R  Package / Case: 0603  [C_ERA-0603]  (hidden comment: C_0603_0.1µF)
C107  Capacitance: 1.0µF  Voltage - Rated: 16V  Temperature Coefficient: X7R  Package / Case: 0603  [C_ERA-0603]  (hidden comment: 1.0uF)
J21  Mounting Type: Through Hole  [HDR_1X2]  (hidden comment: J_HDR1X2_JUMPER)  (no BOM)
J22  Mounting Type: Through Hole  [HDR_1X2]  (hidden comment: J_HDR1X2_JUMPER)  (no BOM)
J23  Headphone Jack  Manufacturer: CUI Inc  Manufacturer Part Number: SJ-43516-SMT-GR  Signal Lines: Stereo  Color: Green  [HEADPHONE_JACK]
L3  Current: 240mA  Package / Case: 0806  Inductance: 22µH  DC Resistance (DCR): 1.8 Ohm  [L_0806]  (hidden comment: CBC2016T220K)
L4  Current: 240mA  Package / Case: 0806  Inductance: 22µH  DC Resistance (DCR): 1.8 Ohm  [L_0806]  (hidden comment: CBC2016T220K)
L5  Current: 240mA  Package / Case: 0806  Inductance: 22µH  DC Resistance (DCR): 1.8 Ohm  [L_0806]  (hidden comment: CBC2016T220K)
L6  Current: 240mA  Package / Case: 0806  Inductance: 22µH  DC Resistance (DCR): 1.8 Ohm  [L_0806]  (hidden comment: CBC2016T220K)
R69  Resistance In Ohms: 10.0K  Power (Watts): 1/16W  Case: 0402  Tolerance: ±1%  [R_0402]  (hidden comment: R_0402_10.0K)
R100  Resistance In Ohms: 10.0K  Power (Watts): 1/16W  Case: 0402  Tolerance: ±1%  [R_0402]  (hidden comment: R_0402_10.0K)
R101  Resistance In Ohms: 10.0K  Power (Watts): 1/16W  Case: 0402  Tolerance: ±1%  [R_0402]  (hidden comment: R_0402_10.0K)
R102  Resistance In Ohms: 10.0K  Power (Watts): 1/16W  Case: 0402  Tolerance: ±1%  [R_0402]  (hidden comment: R_0402_10.0K)
R103  Resistance In Ohms: 10.0K  Power (Watts): 1/16W  Case: 0402  Tolerance: ±1%  [R_0402]  (hidden comment: R_0402_10.0K)
R104  Resistance In Ohms: 10.0K  Power (Watts): 1/16W  Case: 0402  Tolerance: ±1%  [R_0402]  (hidden comment: R_0402_10.0K)
R105  Resistance In Ohms: 10.0K  Power (Watts): 1/16W  Case: 0402  Tolerance: ±1%  [R_0402]  (hidden comment: R_0402_10.0K)
R106  Resistance In Ohms: 10.0K  Power (Watts): 1/16W  Case: 0402  Tolerance: ±1%  [R_0402]  (hidden comment: R_0402_10.0K)
R107  Resistance In Ohms: 68.1K  Power (Watts): 0.1W  Tolerance: ±1%  Case: 0402  [R_0402]  (hidden comment: R_0402_68.1K)
R108  Resistance In Ohms: 5.6K  Power (Watts): 1/10W  Case: 0402  Tolerance: ±1%  [R_0402]  (hidden comment: 5.6k Ohms)
R109  Resistance In Ohms: 18.0K  Power (Watts): 1/16W  Case: 0402  Tolerance: ±1%  [R_0402]  (hidden comment: 18.0k Ohms)
R110  Resistance In Ohms: 10.0K  Power (Watts): 1/16W  Case: 0402  Tolerance: ±1%  [R_0402]  (hidden comment: R_0402_10.0K)
R111  Resistance In Ohms: 5.6K  Power (Watts): 1/10W  Case: 0402  Tolerance: ±1%  [R_0402]  (hidden comment: 5.6k Ohms)
U5  Manufacturer: Texas Instruments  Manufacturer Part Number: TAS5760LDCAR  Type: Class D  Voltage - Supply: 3 V ~ 3.6 V  Supplier Device Package: 48-HTSSOP  [DCA48_6P4X3P6]  (hidden comment: U_TAS5760LDCAR)

### Ports
DR_MUTE_N, HP_DETECT_N, I2C (harness I2C Harness), I2S (harness I2S Harness), SPK_FAULT_N, SPKR_SHTDWN_N

### Harnesses
I2C Harness: SCL, SDA
I2S Harness: MCLK, SCLK, LRCLK, SDIN

### Nets
GND: C89.1 C90.1 C93.1 C94.1 C99.1 C100.1 C101.1 C103.1 C104.1 C105.1 C106.1 C107.1 J23.1(GND) R69.1 R100.1 R109.2 U5.17(DGND) U5.19(DR_INA_P) U5.21(DRGND) U5.27(DRGND) U5.28(DR_UVE) U5.30(DR_INB_P) U5.36(PGND) U5.41(PGND) U5.47(GGND) U5.EPAD
V3P3: C100.2 C101.2 R101.1 R102.1 R103.1 R104.2 R105.2 U5.9(DVDD) U5.26(DRVDD)
VSYS: C103.2 C104.2 C105.2 C106.2 U5.32(PVDD) U5.33(PVDD) U5.44(PVDD) U5.45(PVDD) U5.46(AVDD)
AUDIO_GVDD: C107.2 R107.1 U5.48(GVDD_REG)
DR_MUTE_N: R104.1 U5.22(DR_MUTE_N) ; port DR_MUTE_N
DRA_N: R106.2 R108.2 U5.18(DR_INA_N)
DRA_P: C98.2 J23.2(RIGHT_HP) R106.1 U5.20(DR_OUTA)
DRB_N: R110.2 R111.2 U5.31(DR_INB_N)
DRB_P: C102.2 J23.3(LEFT_HP) R110.1 U5.29(DR_OUTB)
FMC_SCL: U5.8(PBTL/SCL) ; port I2C.SCL
FMC_SDA: U5.7(FREQ/SDA) ; port I2C.SDA
HP_DETECT_N: J23.4(RING) R103.2 ; port HP_DETECT_N
LRCLK: U5.16(LRCK) ; port I2S.LRCLK
MCLK: U5.13(MCLK) ; port I2S.MCLK
SCLK: U5.14(SCLK) ; port I2S.SCLK
SDIN: U5.15(SDIN) ; port I2S.SDIN
SPK_FAULT_N: R105.1 U5.5(SPK_FAULT_N) ; port SPK_FAULT_N
SPKR_SHTDWN_N: R100.2 U5.6(SPK_SD_N) ; port SPKR_SHTDWN_N
NetC56_1: C56.1 L3.1 U5.42(SPK_OUTA+)
NetC56_2: C56.2 U5.43(BSTRPA+)
NetC88_1: C88.1 L4.1 U5.40(SPK_OUTA-)
NetC88_2: C88.2 U5.39(BSTRPA-)
NetC89_2: C89.2 J21.2 L4.2
NetC90_2: C90.2 J21.1 L3.2
NetC91_1: C91.1 L5.1 U5.35(SPK_OUTB+)
NetC91_2: C91.2 U5.34(BSTRPB+)
NetC92_1: C92.1 L6.1 U5.37(SPK_OUTB-)
NetC92_2: C92.2 U5.38(BSTRPB-)
NetC93_2: C93.2 J22.2 L6.2
NetC94_2: C94.2 J22.1 L5.2
NetC95_1: C95.1 C96.2 U5.4(ANA_REF)
NetC95_2: C95.2 U5.2(ANA_REG)
NetC96_1: C96.1 U5.3(VCOM)
NetC97_1: C97.1 U5.24(DR_CN)
NetC97_2: C97.2 U5.25(DR_CP)
NetC98_1: C98.1 R108.1
NetC99_2: C99.2 U5.23(DRVSS)
NetC102_1: C102.1 R111.1
NetR69_2: R69.2 U5.12(SPK_SLEEP/ADR)
NetR101_2: R101.2 U5.11(SPK_GAIN1)
NetR102_2: R102.2 U5.10(SPK_GAIN0)
NetR107_2: R107.2 R109.1 U5.1(SFT_CLIP)

Not connected (* = marked no-connect by the designer): J23 5(RIGHT_FB) 6(LEFT_FB)

### Notes on the sheet
- Through hole connectors for speakers
- SPK_SD_N: Shutdown speaker
- Set SPK_GAIN to '11' for software control
- To avoid popping sounds set the chip to audio mute before shutting down
- I2C Address:
  7-bit: 0x6C
  8-bit: 0xD8
- Project:
- http://www.cospandesign.com
- Cospan Design
- Document:
- Engineer:
- Title:
- Client:
- Approved By:
- Revision:
- Date:
- Number:
- of

### Library data of the parts
C56 C88 C91 C92 = C_0402_0.22UF_50V: CAP CER 0.22UF 50V X5R 0402; Manufacturer: Taiyo Yuden; Manufacturer Part Number: UMK105BJ224KV-F; Tolerance: ±10%; Supplier 1: Digi-Key; RoHS: RoHS Compliant; Category: Capacitors; Stock 1: 141424; Pricing 1: 1=0.35, 10=0.263, 50=0.1532, 100=0.1225, 250=0.08752, 500=0.0595, 1000=0.04813, 5000=0.03763 (USD); Packaging: Digi-Reel®; Mounting Type: Surface Mount, MLCC; Operating Temperature: -55°C ~ 85°C; Applications: General Purpose; Ratings: -; Size / Dimension: 0.039" L x 0.020" W (1.00mm x 0.50mm); Height - Seated (Max): -; Thickness (Max): 0.022" (0.55mm); Lead Spacing: -; Features: -; Lead Style: -; ComponentLink1URL: http://ds.yuden.co.jp/TYCOMPAS/ut/detail.do?productNo=UMK105BJ224KV-F&fileName=UMK105BJ224KV-F_SS&mode=specSheetDownload; ComponentLink1Description: http://ds.yuden.co.jp/TYCOMPAS/ut/detail.do?productNo=UMK105BJ224KV-F&fileName=UMK105BJ224KV-F_SS&mode=specSheetDownload; Supplier Part Number 1: 587-3500-6-ND
C89 C90 C93 C94 = C_0603_0.68uF_25V: CAP CER 0.68UF 25V X5R 0603; Manufacturer: Wurth Electronics Inc.; Manufacturer Part Number: 885012106021; Tolerance: ±20%; Supplier 1: Digi-Key; RoHS: RoHS Compliant; Category: Capacitors; Stock 1: 3388; Pricing 1: 1=0.16, 50=0.131, 100=0.103, 250=0.091, 500=0.083, 1000=0.077 (USD); Packaging: Cut Tape (CT); Part Status: Active; Operating Temperature: -55°C ~ 85°C; Features: -; Ratings: -; Applications: General Purpose; Mounting Type: Surface Mount, MLCC; Size / Dimension: 0.063" L x 0.031" W (1.60mm x 0.80mm); Height - Seated (Max): -; Thickness (Max): 0.037" (0.95mm); Lead Spacing: -; Lead Style: -; ComponentLink1URL: http://katalog.we-online.de/pbs/datasheet/885012106021.pdf; ComponentLink1Description: http://katalog.we-online.de/pbs/datasheet/885012106021.pdf; Supplier Part Number 1: 732-7918-1-ND
C95 C96 = C_0805_1.0uF_50V: CAP CER 1UF 50V X7R 0805; Manufacturer: Murata Electronics North America; Manufacturer Part Number: GRM21BR71H105KA12L; Tolerance: ±10%; Supplier 1: Digi-Key; RoHS: RoHS Compliant; Category: Capacitors; Stock 1: 322160; Pricing 1: 10=0.529, 100=0.3127, 500=0.18038, 1000=0.12506 (USD); Mounting Type: Surface Mount, MLCC; Operating Temperature: -55°C ~ 125°C; Features: -; Applications: General Purpose; Ratings: -; Size / Dimension: 0.079" L x 0.049" W (2.00mm x 1.25mm); Lead Spacing: -; Thickness: 1.25mm; Packaging: Cut Tape (CT); Lead Style: -; ComponentLink1URL: http://search.murata.co.jp/Ceramy/image/img/PDF/ENG/GRM21BR71H105KA12.pdf; ComponentLink1Description: http://search.murata.co.jp/Ceramy/image/img/PDF/ENG/GRM21BR71H105KA12.pdf; Supplier Part Number 1: 490-4736-1-ND; Temperature Coefficient: X7R
C97 C99-C101 C107 = C_0603_1.0uF_16V: as C82 on sheet USB Hub; Supplier 1: Digi-Key; Supplier Part Number 1: 311-1446-1-ND; RoHS: RoHS Compliant; Category: Capacitors; Stock 1: 221087; Tolerance: ±10%; Mounting Type: Surface Mount, MLCC; Operating Temperature: -55°C ~ 125°C; Applications: General Purpose; Ratings: -; Size / Dimension: 0.063" L x 0.032" W (1.60mm x 0.80mm); Height - Seated (Max): -; Thickness (Max): 0.035" (0.90mm); Lead Spacing: -; Features: -; Packaging: Cut Tape (CT); Lead Style: -; ComponentLink1URL: http://www.yageo.com/documents/recent/UPY-GPHC_X7R_6.3V-to-50V_18.pdf; ComponentLink1Description: http://www.yageo.com/documents/recent/UPY-GPHC_X7R_6.3V-to-50V_18.pdf; Pricing 1: 1=0.1, 10=0.053, 100=0.0237, 500=0.01694, 1000=0.01331 (USD); Part Status: Active; Failure Rate: -
C98 C102 = C_0402_220PF_50V: CAP CER 220PF 50V 10% X7R 0402; Manufacturer: Murata Electronics North America; Manufacturer Part Number: GRM155R71H221KA01D; Supplier 1: Digi-Key; Supplier Part Number 1: 490-1298-1-ND; RoHS: RoHS Compliant; Category: Capacitors; Stock 1: 239876; Pricing: 10=0.034, 50=0.0272, 100=0.0204, 250=0.01476, 500=0.0109, 1000=0.00738 (USD); Tolerance: ±10%; Mounting Type: Surface Mount, MLCC; Operating Temperature: -55°C ~ 125°C; Applications: General Purpose; Ratings: -; Size / Dimension: 0.039" L x 0.020" W (1.00mm x 0.50mm); Height: -; Thickness: 0.022" (0.55mm); Lead Spacing: -; Features: -; Packaging: Cut Tape (CT); Lead Style: -; ComponentLink1URL: http://search.murata.co.jp/Ceramy/image/img/PDF/ENG/GRM155R71H221KA01.pdf; ComponentLink1Description: http://search.murata.co.jp/Ceramy/image/img/PDF/ENG/GRM155R71H221KA01.pdf; Capacitance: 220pF
C103 C104 = C_2220_10UF_50V: CAP CER 10UF 50V X7R 20% 2220; Manufacturer: TDK Corporation; Manufacturer Part Number: C5750X7R1H106K230KB; Tolerance: ±10%; Description: CAP CER 10UF 50V X7R 2220; Supplier 1: Digi-Key; RoHS: RoHS Compliant; Category: Capacitors; Stock 1: 35258; Pricing 1: 1=1.96, 10=1.583, 100=1.2087 (USD); Packaging: Cut Tape (CT); Part Status: Active; Operating Temperature: -55°C ~ 125°C; Features: -; Ratings: -; Applications: General Purpose; Failure Rate: -; Mounting Type: Surface Mount, MLCC; Size / Dimension: 0.224" L x 0.197" W (5.70mm x 5.00mm); Height - Seated (Max): -; Thickness (Max): 0.098" (2.50mm); Lead Spacing: -; Lead Style: -; ComponentLink1URL: https://product.tdk.com/info/en/catalog/datasheets/mlcc_commercial_general_en.pdf; ComponentLink1Description: https://product.tdk.com/info/en/catalog/datasheets/mlcc_commercial_general_en.pdf; Supplier Part Number 1: 445-3492-1-ND; Capacitance: 10µF
C105 C106 = C_0603_0.1µF: CAP CER 0.1UF 50V X7R 0603; Manufacturer: Samsung Electro-Mechanics America, Inc.; Manufacturer Part Number: CL10B104KB8SFNC; Tolerance: ±10%; Supplier 1: Digi-Key; RoHS: RoHS Compliant; Category: Capacitors; Stock 1: 1364172; Pricing 1: 1=0.1, 10=0.027, 25=0.0192, 50=0.0148, 100=0.0125, 500=0.00874, 1000=0.00681 (USD); Packaging: Cut Tape (CT); Mounting Type: Surface Mount, MLCC; Operating Temperature: -55°C ~ 125°C; Applications: Boardflex Sensitive; Ratings: -; Size / Dimension: 0.063" L x 0.031" W (1.60mm x 0.80mm); Height - Seated (Max): -; Thickness (Max): 0.035" (0.90mm); Lead Spacing: -; Features: Soft Termination; Lead Style: -; ComponentLink1URL: http://www.samsungsem.com/kr/support/product-search/mlcc/CL10B104KB8SFNC.jsp; ComponentLink1Description: http://www.samsungsem.com/kr/support/product-search/mlcc/CL10B104KB8SFNC.jsp; Supplier Part Number 1: 1276-1936-1-ND; Supplier 2: Digi-Key; Stock 2: 470947; Pricing 2: 1=0.1, 10=0.026, 50=0.0144, 100=0.0121, 250=0.00992, 500=0.00848, 1000=0.0066 (USD); ComponentLink2URL: http://www.kemet.com/docfinder?Partnumber=C0603C104M5RACTU; ComponentLink2Description: http://www.kemet.com/docfinder?Partnumber=C0603C104M5RACTU; Supplier Part Number 2: 399-7845-1-ND
J21 J22 = J_HDR1X2_JUMPER: CONN HEADER .100" 2POS TIN PCB; Manufacturer: Samtec; Manufacturer Part Number: TSW-102-07-T-S; Number of Positions: 2; Connector Type: Unshrouded; Number of Positions Loaded: All; Pitch: 0.100" (2.54mm); NOTE: This is a 1X12 header; Category: Connectors, Interconnects; Number of Rows: 1; Supplier 1: Samtec; Supplier Part Number 1: TSW-102-07-T-S; RoHS: RoHS Compliant; Row Spacing: -; Height Stacking (Mating): -; Molding Height Above Board: 0.100" (2.54mm); Contact Mating Length: 0.166" (4.22mm); Termination: Solder; Contact Finish: Tin; Contact Finish Thickness: 200µin (5.08µm); Features: -; Color: Black; ComponentLink1URL: http://www.samtec.com/ftppub/pdf/TD.PDF; ComponentLink1Description: http://www.samtec.com/ftppub/pdf/TD.PDF
J23 = J_HEADPHONE_JACK: CONN AUDIO JACK 3.5MM 4COND SMD; Gender: Female; Plug/Mating Plug Diameter: 3.50mm (0.141", 1/8", Mini Plug) - Headphone; Number of Positions/Contacts: 4 Conductors, 6 Contacts; Internal Switch(s): Two Switches; Shielding: Unshielded; Supplier 1: Digi-Key; Supplier Part Number 1: CP-43516SJGRCT-ND; RoHS: RoHS Compliant; Category: Connectors, Interconnects; Stock 1: 3934; Pricing: 1=1.26, 10=0.982, 100=0.749, 500=0.59796 (USD); Connector Type: Phone Jack; Mounting Type: Surface Mount, Right Angle; Termination: Solder; Features: Board Guide; Packaging: Cut Tape (CT); ComponentLink1URL: http://products.cui.com/GetSpecForDigikey.aspx?MFGNum=SJ-43516-SMT; ComponentLink1Description: http://products.cui.com/GetSpecForDigikey.aspx?MFGNum=SJ-43516-SMT
L3-L6 = L_0806_22uH: INDUCTOR 22UH 10% 0806 SMD; Manufacturer: Taiyo Yuden; Type: Wirewound; Current - Saturation: 250mA; Shielding: Unshielded; Frequency - Self Resonant: 16MHz; Frequency - Test: 2.52MHz; Supplier 1: Digi-Key; Supplier Part Number 1: 587-3048-1-ND; Manufacturer Part Number: CBC2016T220K; RoHS: RoHS Compliant; Category: Inductors, Coils, Chokes; Stock 1: 3275; Pricing: 1=0.2, 10=0.192, 50=0.18, 100=0.168, 500=0.132, 1000=0.108 (USD); Packaging: Cut Tape (CT); Material - Core: -; Tolerance: ±10%; Current Rating: 240mA; Q @ Freq: -; Operating Temperature: -40°C ~ 105°C; Mounting Type: Surface Mount; Size / Dimension: 0.079" L x 0.063"W (2.00mm x 1.60mm); Height - Seated (Max): 0.071" (1.80mm); Supplier Device Package: 0806 (2016 Metric); ComponentLink1URL: http://www.yuden.co.jp/ut/product/category/inductor/CBC2016T220K.pdf; ComponentLink1Description: http://www.yuden.co.jp/ut/product/category/inductor/CBC2016T220K.pdf
R69 R100-R106 R110 = R_0402_10.0K: as R87 on sheet USB Hub; Supplier 1: Digi-Key; Supplier Part Number 1: RMCF0402FT10K0CT-ND; RoHS: RoHS Compliant; Category: Resistors; Stock 1: 234525; Pricing: 1=0.04, 10=0.025, 50=0.0138, 100=0.0105, 250=0.0078, 500=0.00576, 1000=0.00384, 2500=0.00324, 5000=0.0027 (USD); Composition: Thick Film; Features: -; Package / Case: 0402 (1005 Metric); Size / Dimension: 0.039" L x 0.020" W (1.00mm x 0.50mm); Height: 0.016" (0.40mm); Number of Terminations: 2; Packaging: Cut Tape (CT); ComponentLink1URL: http://www.seielect.com/Catalog/SEI-RMCF_RMCP.pdf; ComponentLink1Description: http://www.seielect.com/Catalog/SEI-RMCF_RMCP.pdf
R107 = R_0402_68.1K: RES 68.1K OHM 1/10W 1% 0402 SMD; Manufacturer: Panasonic - ECG; Manufacturer Part Number: ERJ-2RKF6812X; Temperature Coefficient: ±100ppm/°C; Supplier 1: Digi-Key; Supplier Part Number 1: P68.1KLCT-ND; RoHS: RoHS Compliant; Category: Resistors; Stock 1: 314739; Pricing: 1=0.06, 50=0.0242, 100=0.0184, 250=0.01364, 500=0.01008, 1000=0.00672, 5000=0.00473 (USD); Resistance (Ohms): 68.1K; Composition: Thick Film; Features: -; Size / Dimension: 0.039" L x 0.020" W (1.00mm x 0.50mm); Height: 0.014" (0.35mm); Number of Terminations: 2; Packaging: Cut Tape (CT); Package / Case: 0402 (1005 Metric); ComponentLink1URL: http://industrial.panasonic.com/www-cgi/jvcr13pz.cgi?E+PZ+3+AOA0002+ERJ2RKF6812X+7+WW; ComponentLink1Description: http://industrial.panasonic.com/www-cgi/jvcr13pz.cgi?E+PZ+3+AOA0002+ERJ2RKF6812X+7+WW
R108 R111 = R_0402_5.6K: RES 5.60K OHM 1/10W 1% 0402 SMD; Manufacturer: Yageo; Manufacturer Part Number: RC0402FR-075K6L; Temperature Coefficient: ±100ppm/°C; Description: RES SMD 5.6K OHM 1% 1/16W 0402; Supplier 1: Digi-Key; Supplier Part Number 1: 311-5.6KLRCT-ND; RoHS: RoHS Compliant; Category: Resistors; Stock 1: 1026789; Composition: Thick Film; Features: Moisture Resistant; Package / Case: 0402 (1005 Metric); Size / Dimension: 0.039" L x 0.020" W (1.00mm x 0.50mm); Packaging: Cut Tape (CT); ComponentLink1URL: http://www.yageo.com/documents/recent/PYu-RC_Group_51_RoHS_L_7.pdf; ComponentLink1Description: http://www.yageo.com/documents/recent/PYu-RC_Group_51_RoHS_L_7.pdf; Pricing 1: 1=0.1, 10=0.014, 100=0.0056, 1000=0.00253, 2500=0.0022, 5000=0.00181 (USD); Part Status: Active; Operating Temperature: -55°C ~ 155°C; Supplier Device Package: 0402; Height - Seated (Max): 0.016" (0.40mm); Failure Rate: -
R109 = R_0402_18.0K: RES SMD 18K OHM 1% 1/16W 0402; Manufacturer: Yageo; Manufacturer Part Number: RC0402FR-0718KL; Temperature Coefficient: ±100ppm/°C; Supplier 1: Digi-Key; Supplier Part Number 1: 311-18.0KLRCT-ND; RoHS: RoHS Compliant; Category: Resistors; Stock 1: 2103351; Pricing: 10=0.014, 100=0.0063, 500=0.00382, 1000=0.0027, 5000=0.00203 (USD); Resistance (Ohms): 18K; Composition: Thick Film; Features: -; Package / Case: 0402 (1005 Metric); Size / Dimension: 0.039" L x 0.020" W (1.00mm x 0.50mm); Height: 0.016" (0.40mm); Number of Terminations: 2; Packaging: Cut Tape (CT); ComponentLink1URL: http://www.yageo.com/documents/recent/PYu-RC0402_51_RoHS_L_6.pdf; ComponentLink1Description: http://www.yageo.com/documents/recent/PYu-RC0402_51_RoHS_L_6.pdf
U5 = U_TAS5760LDCAR: IC AUDIO AMP DGTL D 48HTSSOP; Output Type: 1-Channel (Mono) or 2-Channel (Stereo); Supplier 1: Digi-Key; RoHS: RoHS Compliant; Category: Integrated Circuits (ICs); Stock 1: 1188; Pricing 1: 1=4.64, 10=4.17, 100=3.4165, 500=2.90836, 1000=2.45284 (USD); Packaging: Cut Tape (CT); Part Status: Active; Max Output Power x Channels @ Load: -; Features: Depop; Mounting Type: Surface Mount; Operating Temperature: -25°C ~ 85°C (TA); Package / Case: 48-TFSOP (0.240", 6.10mm Width) Exposed Pad; ComponentLink1URL: http://www.ti.com/lit/ds/symlink/tas5760l.pdf; ComponentLink1Description: http://www.ti.com/lit/ds/symlink/tas5760l.pdf; Supplier Part Number 1: 296-40566-1-ND